# EAGLE schematic stm32-2inch40-usb-sd-proto (EAGLE 6.6.0)
+proto USB/SD 40 pin mesonine module. 2 inch beetween pinheads.

## Sheet 1 of 3
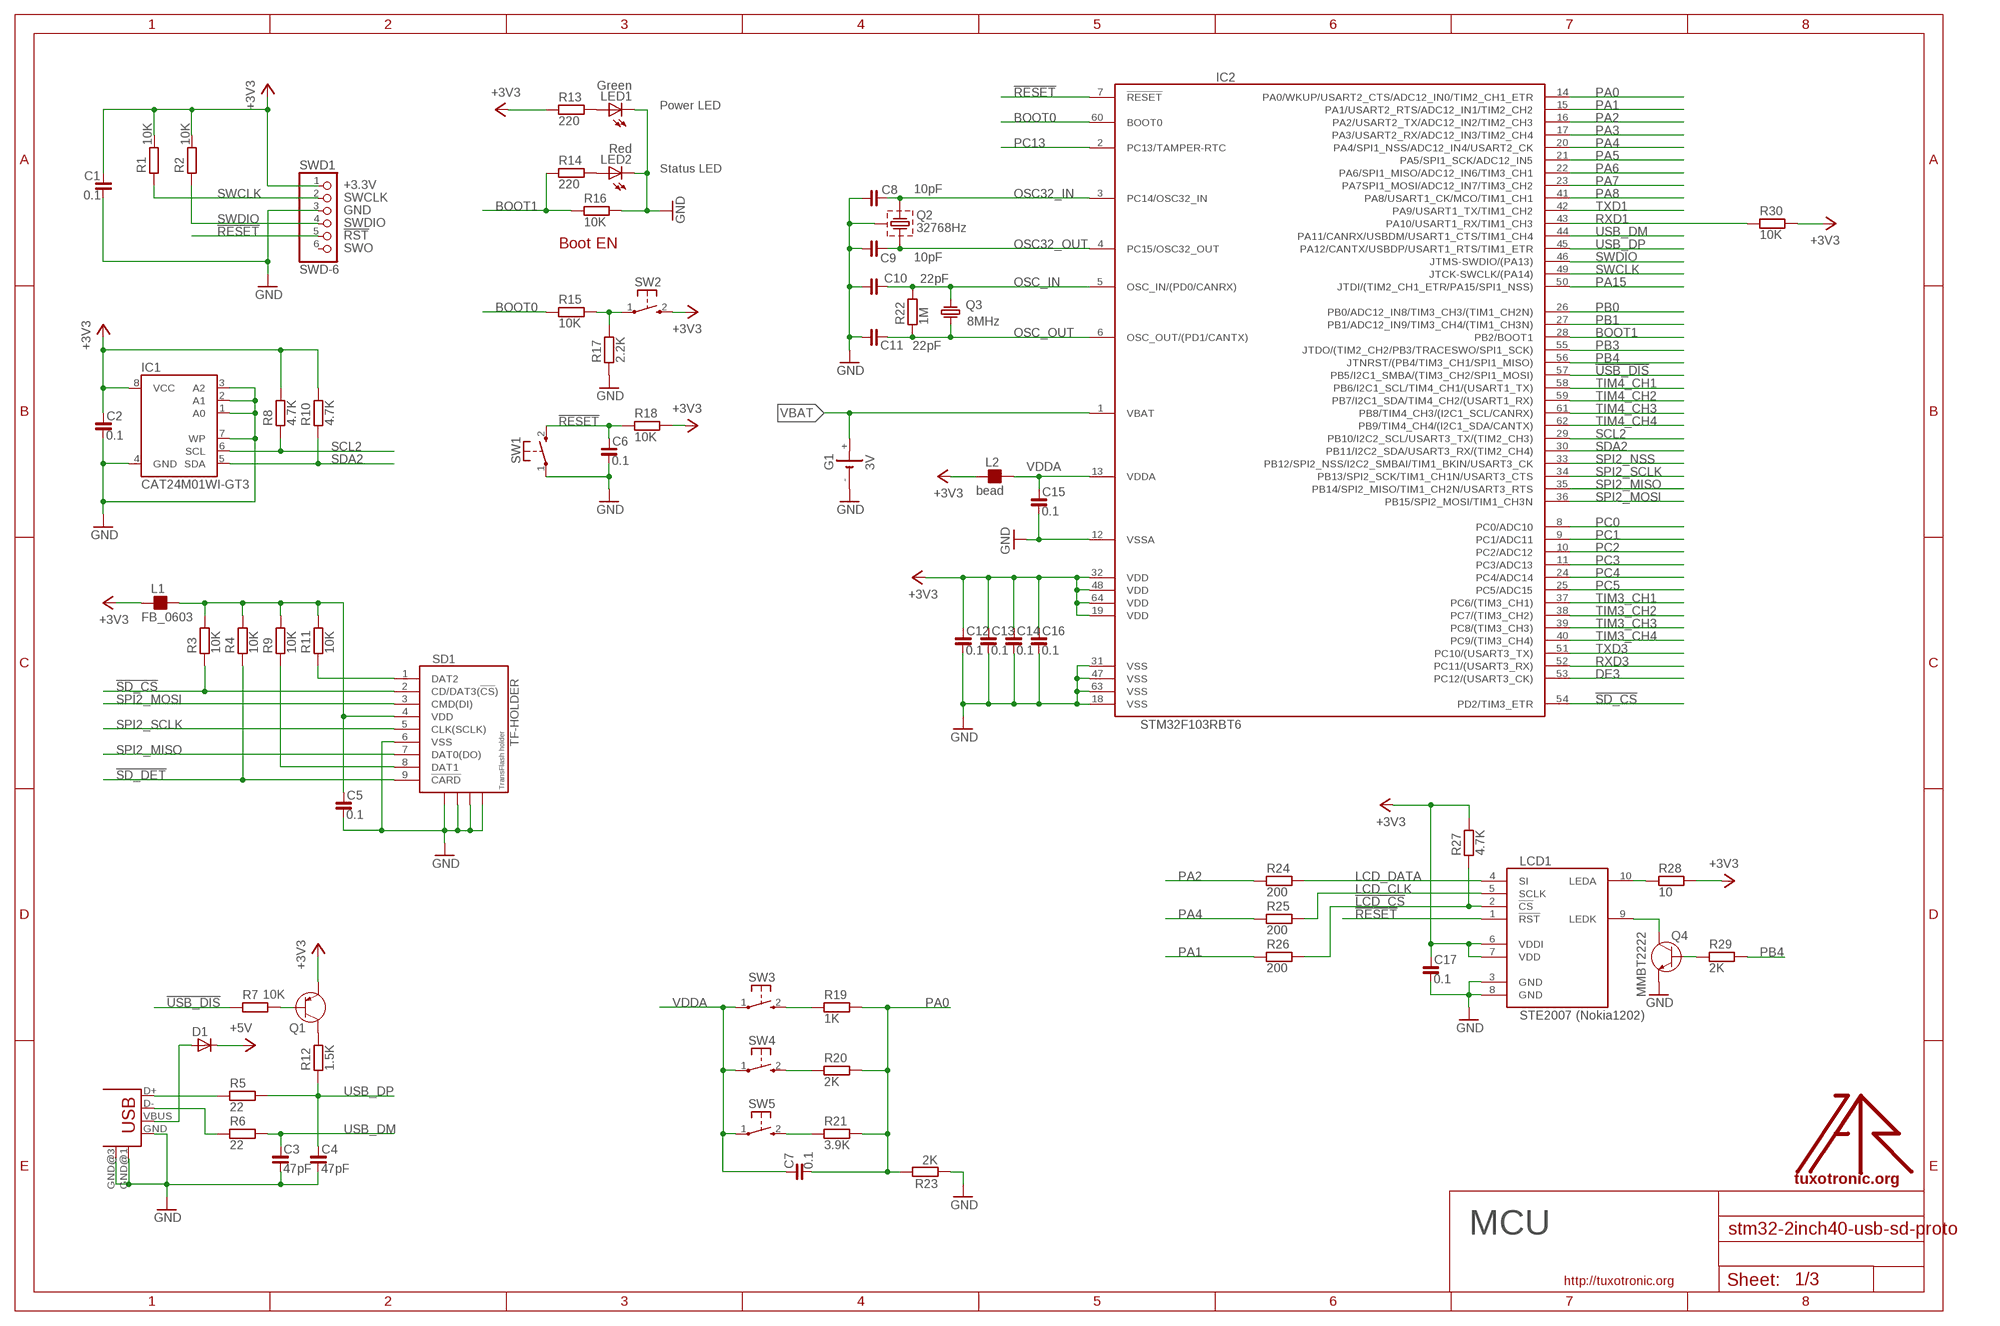
[diagram p0: schematic, sheet 1]

### Parts
C1  0.1  C_0603  [C0603]
C2  0.1  C_0603  [C0603]
C3  47pF  C_0603  [C0603]
C4  47pF  C_0603  [C0603]
C5  0.1  C_0603  [C0603]
C6  0.1  C_0603  [C0603]
C7  0.1  C_0603  [C0603]
C8  10pF  C_0603  [C0603]
C9  10pF  C_0603  [C0603]
C10  22pF  C_0603  [C0603]
C11  22pF  C_0603  [C0603]
C12  0.1  C_0603  [C0603]
C13  0.1  C_0603  [C0603]
C14  0.1  C_0603  [C0603]
C15  0.1  C_0603  [C0603]
C16  0.1  C_0603  [C0603]
C17  0.1  C_0603  [C0603]
D1  D-SOD-87  [SOD87]
G1  3V  1220SMT  [SMT1220]
IC1  CAT24M01WI-GT3  AT24C256S  [SO08]
IC2  STM32F103RBT6  STM32F103R  [TQFP64]
L1  FB_0603  [L0603]
L2  bead  FB_0603  [L0603]
LCD1  STE2007 (Nokia1202)  LCD1202-EXT  [NOKIA1202LCD-EXT]
LED1  Green  LEDCHIP-LED0805  [CHIP-LED0805]
LED2  Red  LEDCHIP-LED0805  [CHIP-LED0805]
LOGO1  LOGO  [TT_LOGO]
Q1  PNP-SOT23  [SOT23]
Q2  32768Hz  CRSTL3-  [TC38H-G]
Q3  8MHz  CRYSTAL-HC49S  [HC49/S]
Q4  MMBT2222  [SOT23]
R1  10K  R_0603  [R0603]
R2  10K  R_0603  [R0603]
R3  10K  R_0603  [R0603]
R4  10K  R_0603  [R0603]
R5  22  R_0603  [R0603]
R6  22  R_0603  [R0603]
R7  10K  R_0603  [R0603]
R8  4.7K  R_0603  [R0603]
R9  10K  R_0603  [R0603]
R10  4.7K  R_0603  [R0603]
R11  10K  R_0603  [R0603]
R12  1.5K  R_0603  [R0603]
R13  220  R_0603  [R0603]
R14  220  R_0603  [R0603]
R15  10K  R_0603  [R0603]
R16  10K  R_0603  [R0603]
R17  2.2K  R_0603  [R0603]
R18  10K  R_0603  [R0603]
R19  1K  R_0603  [R0603]
R20  2K  R_0603  [R0603]
R21  3.9K  R_0603  [R0603]
R22  1M  R_0603  [R0603]
R23  2K  R_0603  [R0603]
R24  200  R_0603  [R0603]
R25  200  R_0603  [R0603]
R26  200  R_0603  [R0603]
R27  4.7K  R_0603  [R0603]
R28  10  R_0603  [R0603]
R29  2K  R_0603  [R0603]
R30  10K  R_0603  [R0603]
SD1  TF-HOLDER  [TF-PULL]
SW1  KSS-2EG4430  [KSS-2EG4430]
SW2  KSS-2EG4430  [KSS-2EG4430]
SW3  KSS-2EG4430  [KSS-2EG4430]
SW4  KSS-2EG4430  [KSS-2EG4430]
SW5  KSS-2EG4430  [KSS-2EG4430]
SWD1  SWD-6  [JTAG6PIN]
USB1  USB-MB-S  [USB-MB-S]

### Nets
!LCD_CS: LCD1.2(!CS) R26.2 R27.1
!RESET: C6.1 IC2.7(!RESET) LCD1.1(!RST) R18.1 SW1.2(S) SWD1.5
!SD_CS: IC2.54(PD2/TIM3_ETR) R3.1 SD1.2(CD/DAT3(!CS!))
!SD_DET: R4.1 SD1.9(!CARD)
!USB_DIS: IC2.57(PB5/I2C1_SMBA/(TIM3_CH2/SPI1_MOSI)) R7.1
+3V3: C1.1 C2.1 C12.1 C13.1 C14.1 C16.1 C17.1 IC1.8(VCC) IC2.19(VDD) IC2.32(VDD) IC2.48(VDD) IC2.64(VDD) L1.1 L2.1 LCD1.6(VDDI) LCD1.7(VDD) Q1.2(E) R1.2 R2.2 R8.2 R10.2 R13.1 R18.2 R27.2 R28.2 R30.2 SW2.2(S) SWD1.1 ; also sheet 2
+5V: D1.1(C) ; also sheet 2
BOOT0: IC2.60(BOOT0) R15.1
BOOT1: IC2.28(PB2/BOOT1) R14.1 R16.1
DE3: IC2.53(PC12/(USART3_CK)) ; also sheet 2
GND: C1.2 C2.2 C3.2 C4.2 C5.2 C6.2 C8.2 C9.2 C10.2 C11.2 C12.2 C13.2 C14.2 C15.2 C16.2 C17.2 G1.- IC1.1(A0) IC1.2(A1) IC1.3(A2) IC1.4(GND) IC1.7(WP) IC2.12(VSSA) IC2.18(VSS) IC2.31(VSS) IC2.47(VSS) IC2.63(VSS) LCD1.3(GND) LCD1.8(GND) LED1.C LED2.C Q2.GND Q4.2(E) R16.2 R17.1 R23.1 SD1.6(VSS) SD1.S1 SD1.S2 SD1.S3 SD1.S4 SW1.1(P) SWD1.3 USB1.GND USB1.GND@1(GND) USB1.GND@3(GND) ; also sheet 2
LCD_CLK: LCD1.5(SCLK) R25.2
LCD_DATA: LCD1.4(SI) R24.2
N$1: Q1.3(C) R12.2
N$2: D1.2(A) USB1.VBUS
N$3: R15.2 R17.2 SW2.1(P)
N$7: C5.1 L1.2 R3.2 R4.2 R9.2 R11.2 SD1.4(VDD)
N$8: R11.1 SD1.1(DAT2)
N$9: R9.1 SD1.8(DAT1)
N$10: R5.1 USB1.D+
N$13: LED1.A R13.2
N$29: LCD1.9(LEDK) Q4.3(C)
N$30: LED2.A R14.2
N$31: LCD1.10(LEDA) R28.1
N$32: Q4.1(B) R29.1
N$33: R19.1 SW3.2(S)
N$34: R20.1 SW4.2(S)
N$35: R21.1 SW5.2(S)
N$36: R6.1 USB1.D-
N$38: Q1.1(B) R7.2
OSC32_IN: C8.1 IC2.3(PC14/OSC32_IN) Q2.2
OSC32_OUT: C9.1 IC2.4(PC15/OSC32_OUT) Q2.1
OSC_IN: C10.1 IC2.5(OSC_IN/(PD0/CANRX)) Q3.1 R22.2
OSC_OUT: C11.1 IC2.6(OSC_OUT/(PD1/CANTX)) Q3.2 R22.1
PA0: C7.2 IC2.14(PA0/WKUP/USART2_CTS/ADC12_IN0/TIM2_CH1_ETR) R19.2 R20.2 R21.2 R23.2 ; also sheet 2
PA1: IC2.15(PA1/USART2_RTS/ADC12_IN1/TIM2_CH2) R26.1 ; also sheet 2
PA2: IC2.16(PA2/USART2_TX/ADC12_IN2/TIM2_CH3) R24.1 ; also sheet 2
PA3: IC2.17(PA3/USART2_RX/ADC12_IN3/TIM2_CH4) ; also sheet 2
PA4: IC2.20(PA4/SPI1_NSS/ADC12_IN4/USART2_CK) R25.1 ; also sheet 2
PA5: IC2.21(PA5/SPI1_SCK/ADC12_IN5) ; also sheet 2
PA6: IC2.22(PA6/SPI1_MISO/ADC12_IN6/TIM3_CH1) ; also sheet 2
PA7: IC2.23(PA7SPI1_MOSI/ADC12_IN7/TIM3_CH2) ; also sheet 2
PA8: IC2.41(PA8/USART1_CK/MCO/TIM1_CH1) ; also sheet 2
PA15: IC2.50(JTDI/(TIM2_CH1_ETR/PA15/SPI1_NSS)) ; also sheet 2
PB0: IC2.26(PB0/ADC12_IN8/TIM3_CH3/(TIM1_CH2N)) ; also sheet 2
PB1: IC2.27(PB1/ADC12_IN9/TIM3_CH4/(TIM1_CH3N)) ; also sheet 2
PB3: IC2.55(JTDO/(TIM2_CH2/PB3/TRACESWO/SPI1_SCK)) ; also sheet 2
PB4: IC2.56(JTNRST/(PB4/TIM3_CH1/SPI1_MISO)) R29.2
PC0: IC2.8(PC0/ADC10) ; also sheet 2
PC1: IC2.9(PC1/ADC11) ; also sheet 2
PC2: IC2.10(PC2/ADC12) ; also sheet 2
PC3: IC2.11(PC3/ADC13) ; also sheet 2
PC4: IC2.24(PC4/ADC14) ; also sheet 2
PC5: IC2.25(PC5/ADC15) ; also sheet 2
PC13: IC2.2(PC13/TAMPER-RTC) ; also sheet 2
RXD1: IC2.43(PA10/USART1_RX/TIM1_CH3) R30.1 ; also sheet 2
RXD3: IC2.52(PC11/(USART3_RX)) ; also sheet 2
SCL2: IC1.6(SCL) IC2.29(PB10/I2C2_SCL/USART3_TX/(TIM2_CH3)) R8.1 ; also sheet 2
SDA2: IC1.5(SDA) IC2.30(PB11/I2C2_SDA/USART3_RX/(TIM2_CH4)) R10.1 ; also sheet 2
SPI2_MISO: IC2.35(PB14/SPI2_MISO/TIM1_CH2N/USART3_RTS) SD1.7(DAT0(DO)) ; also sheet 2
SPI2_MOSI: IC2.36(PB15/SPI2_MOSI/TIM1_CH3N) SD1.3(CMD(DI)) ; also sheet 2
SPI2_NSS: IC2.33(PB12/SPI2_NSS/I2C2_SMBAI/TIM1_BKIN/USART3_CK) ; also sheet 2
SPI2_SCLK: IC2.34(PB13/SPI2_SCK/TIM1_CH1N/USART3_CTS) SD1.5(CLK(SCLK)) ; also sheet 2
SWCLK: IC2.49(JTCK-SWCLK/(PA14)) R1.1 SWD1.2
SWDIO: IC2.46(JTMS-SWDIO/(PA13)) R2.1 SWD1.4
TIM3_CH1: IC2.37(PC6/(TIM3_CH1)) ; also sheet 2
TIM3_CH2: IC2.38(PC7/(TIM3_CH2)) ; also sheet 2
TIM3_CH3: IC2.39(PC8/(TIM3_CH3)) ; also sheet 2
TIM3_CH4: IC2.40(PC9/(TIM3_CH4)) ; also sheet 2
TIM4_CH1: IC2.58(PB6/I2C1_SCL/TIM4_CH1/(USART1_TX)) ; also sheet 2
TIM4_CH2: IC2.59(PB7/I2C1_SDA/TIM4_CH2/(USART1_RX)) ; also sheet 2
TIM4_CH3: IC2.61(PB8/TIM4_CH3/(I2C1_SCL/CANRX)) ; also sheet 2
TIM4_CH4: IC2.62(PB9/TIM4_CH4/(I2C1_SDA/CANTX)) ; also sheet 2
TXD1: IC2.42(PA9/USART1_TX/TIM1_CH2) ; also sheet 2
TXD3: IC2.51(PC10/(USART3_TX)) ; also sheet 2
USB_DM: C3.1 IC2.44(PA11/CANRX/USBDM/USART1_CTS/TIM1_CH4) R6.2
USB_DP: C4.1 IC2.45(PA12/CANTX/USBDP/USART1_RTS/TIM1_ETR) R5.2 R12.1
VBAT: G1.+ IC2.1(VBAT)
VDDA: C7.1 C15.1 IC2.13(VDDA) L2.2 SW3.1(P) SW4.1(P) SW5.1(P)
Unconnected: SWD1.6

### Notes on the sheet
- Power LED
- Status LED
- Boot EN
- MCU

## Sheet 2 of 3
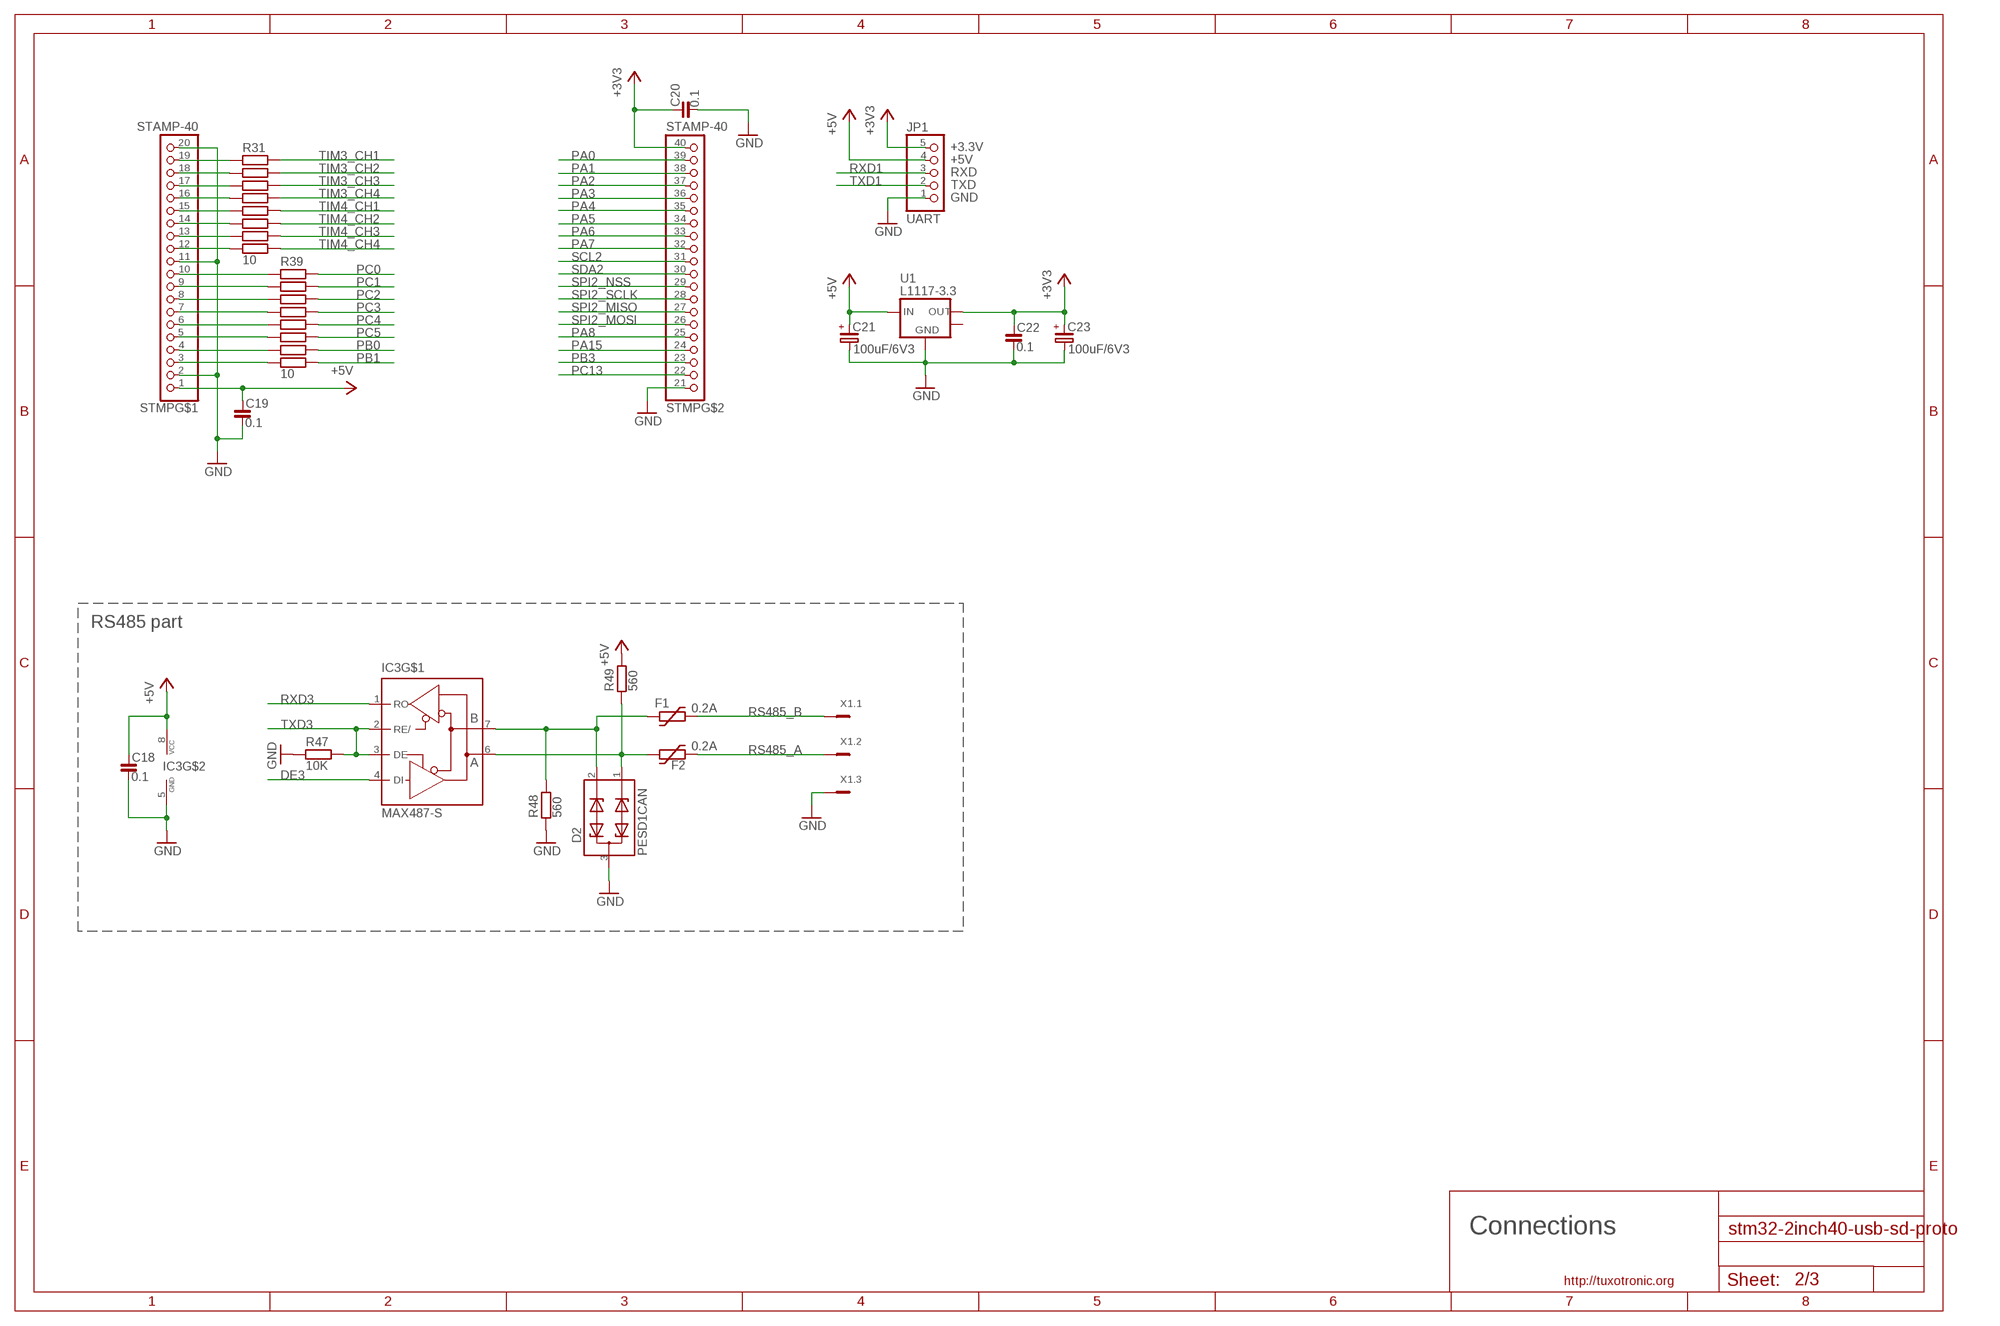
[diagram p1: schematic, sheet 2]

### Parts
C18  0.1  C_0603  [C0603]
C19  0.1  C_0805  [C0805]
C20  0.1  C_0805  [C0805]
C21  100uF/6V3  CP_SMCD  [SMC_D]
C22  0.1  C_0805  [C0805]
C23  100uF/6V3  CP_SMCD  [SMC_D]
D2  PESD1CAN  [SOT23]
F1  0.2A  1206L  [1206L]
F2  0.2A  1206L  [1206L]
IC3  MAX487-S  [SO08]
JP1  UART  UART-5_2.54  [UART_1X05]
R31  10  R_0603  [R0603]
R32  10  R_0603  [R0603]
R33  10  R_0603  [R0603]
R34  10  R_0603  [R0603]
R35  10  R_0603  [R0603]
R36  10  R_0603  [R0603]
R37  10  R_0603  [R0603]
R38  10  R_0603  [R0603]
R39  10  R_0603  [R0603]
R40  10  R_0603  [R0603]
R41  10  R_0603  [R0603]
R42  10  R_0603  [R0603]
R43  10  R_0603  [R0603]
R44  10  R_0603  [R0603]
R45  10  R_0603  [R0603]
R46  10  R_0603  [R0603]
R47  10K  R_0603  [R0603]
R48  560  R_0603  [R0603]
R49  560  R_0603  [R0603]
STMP  STAMP-40  [STAMP-40]
U1  L1117-3.3  LM1117-3.3  [SOT223]
X1  MCV3  [MCV3]

### Nets
+3V3: C20.1 C22.1 C23.+ JP1.5 STMP.40 U1.2(OUT) ; also sheet 1
+5V: C18.1 C19.1 C21.+ IC3.8(VCC) JP1.4 R49.2 STMP.1 U1.3(IN) ; also sheet 1
DE3: IC3.4(DI) ; also sheet 1
GND: C18.2 C19.2 C20.2 C21.- C22.2 C23.- D2.3 IC3.5(GND) JP1.1 R47.1 R48.1 STMP.2 STMP.11 STMP.20 STMP.21 U1.1(GND) X1.3 ; also sheet 1
N$6: D2.2 F1.P$1 IC3.7(B) R48.2
N$11: R39.1 STMP.10
N$14: R40.1 STMP.9
N$15: R31.1 STMP.19
N$16: R32.1 STMP.18
N$17: R33.1 STMP.17
N$18: R34.1 STMP.16
N$19: R35.1 STMP.15
N$20: R36.1 STMP.14
N$21: R37.1 STMP.13
N$22: R38.1 STMP.12
N$23: R41.1 STMP.8
N$24: R42.1 STMP.7
N$25: R43.1 STMP.6
N$26: R44.1 STMP.5
N$27: R45.1 STMP.4
N$28: R46.1 STMP.3
N$44: D2.1 F2.P$1 IC3.6(A) R49.1
PA0: STMP.39 ; also sheet 1
PA1: STMP.38 ; also sheet 1
PA2: STMP.37 ; also sheet 1
PA3: STMP.36 ; also sheet 1
PA4: STMP.35 ; also sheet 1
PA5: STMP.34 ; also sheet 1
PA6: STMP.33 ; also sheet 1
PA7: STMP.32 ; also sheet 1
PA8: STMP.25 ; also sheet 1
PA15: STMP.24 ; also sheet 1
PB0: R45.2 ; also sheet 1
PB1: R46.2 ; also sheet 1
PB3: STMP.23 ; also sheet 1
PC0: R39.2 ; also sheet 1
PC1: R40.2 ; also sheet 1
PC2: R41.2 ; also sheet 1
PC3: R42.2 ; also sheet 1
PC4: R43.2 ; also sheet 1
PC5: R44.2 ; also sheet 1
PC13: STMP.22 ; also sheet 1
RS485_A: F2.P$2 X1.2
RS485_B: F1.P$2 X1.1
RXD1: JP1.3 ; also sheet 1
RXD3: IC3.1(RO) ; also sheet 1
SCL2: STMP.31 ; also sheet 1
SDA2: STMP.30 ; also sheet 1
SPI2_MISO: STMP.27 ; also sheet 1
SPI2_MOSI: STMP.26 ; also sheet 1
SPI2_NSS: STMP.29 ; also sheet 1
SPI2_SCLK: STMP.28 ; also sheet 1
TIM3_CH1: R31.2 ; also sheet 1
TIM3_CH2: R32.2 ; also sheet 1
TIM3_CH3: R33.2 ; also sheet 1
TIM3_CH4: R34.2 ; also sheet 1
TIM4_CH1: R35.2 ; also sheet 1
TIM4_CH2: R36.2 ; also sheet 1
TIM4_CH3: R37.2 ; also sheet 1
TIM4_CH4: R38.2 ; also sheet 1
TXD1: JP1.2 ; also sheet 1
TXD3: IC3.2(RE/) IC3.3(DE) R47.2 ; also sheet 1
Unconnected: U1.4(MASS)

### Notes on the sheet
- RS485 part
- Connections

## Sheet 3 of 3
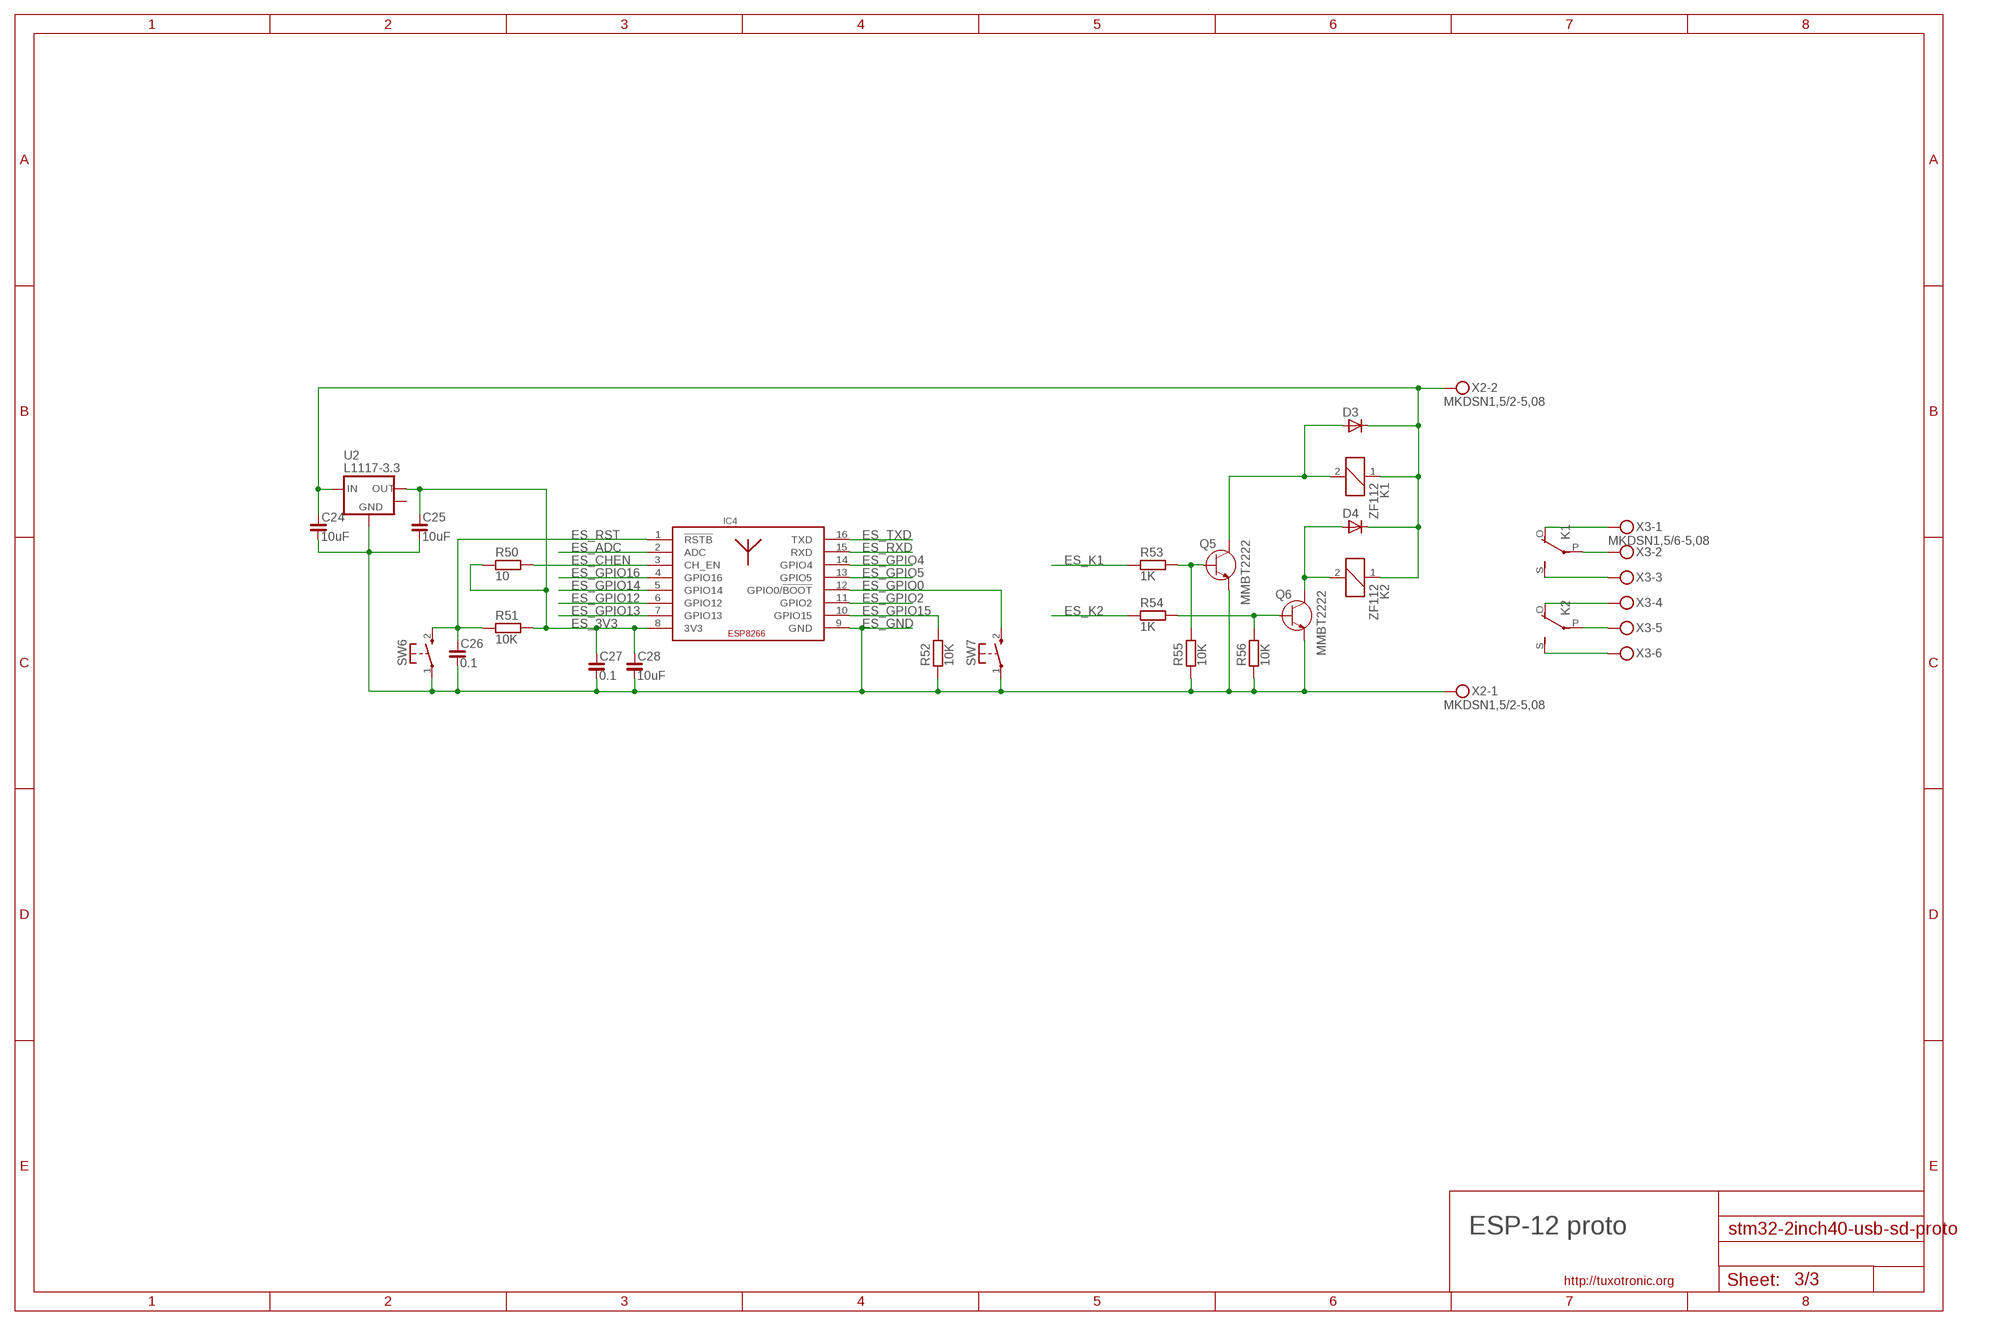
[diagram p2: schematic, sheet 3]

### Parts
C24  10uF  C_0805  [C0805]
C25  10uF  C_0805  [C0805]
C26  0.1  C_0805  [C0805]
C27  0.1  C_0805  [C0805]
C28  10uF  C_0805  [C0805]
D3  D-SOD-80  [SOD80]
D4  D-SOD-80  [SOD80]
IC4  ESP-12  [ESP12]
K1  ZF112  [ZF112]
K2  ZF112  [ZF112]
Q5  MMBT2222  [SOT23]
Q6  MMBT2222  [SOT23]
R50  10  R_0805  [R0805]
R51  10K  R_0805  [R0805]
R52  10K  R_0805  [R0805]
R53  1K  R_0805  [R0805]
R54  1K  R_0805  [R0805]
R55  10K  R_0805  [R0805]
R56  10K  R_0805  [R0805]
SW6  KSS-2EG4430  [KSS-2EG4430]
SW7  KSS-2EG4430  [KSS-2EG4430]
U2  L1117-3.3  LM1117-3.3  [SOT223]
X2  MKDSN1,5/2-5,08  [MKDSN1,5/2-5,08]
X3  MKDSN1,5/6-5,08  [MKDSN1,5/6-5,08]

### Nets
+5V1: C24.1 D3.1(C) D4.1(C) K1.1 K2.1 U2.3(IN) X2.2
ES_3V3: C25.1 C27.1 C28.1 IC4.8(3V3) R50.1 R51.2 U2.2(OUT)
ES_ADC: IC4.2(ADC)
ES_CHEN: IC4.3(CH_EN) R50.2
ES_GND: C24.2 C25.2 C26.2 C27.2 C28.2 IC4.9(GND) Q5.2(E) Q6.2(E) R52.1 R55.1 R56.1 SW6.1(P) SW7.1(P) U2.1(GND) X2.1
ES_GPIO0: IC4.12(GPIO0/!BOOT) SW7.2(S)
ES_GPIO2: IC4.11(GPIO2)
ES_GPIO4: IC4.14(GPIO4)
ES_GPIO5: IC4.13(GPIO5)
ES_GPIO12: IC4.6(GPIO12)
ES_GPIO13: IC4.7(GPIO13)
ES_GPIO14: IC4.5(GPIO14)
ES_GPIO15: IC4.10(GPIO15) R52.2
ES_GPIO16: IC4.4(GPIO16)
ES_K1: R53.1
ES_K2: R54.1
ES_RST: C26.1 IC4.1(!RSTB) R51.1 SW6.2(S)
ES_RXD: IC4.15(RXD)
ES_TXD: IC4.16(TXD)
N$37: Q6.1(B) R54.2 R56.2
N$41: D4.2(A) K2.2 Q6.3(C)
N$42: D3.2(A) K1.2 Q5.3(C)
N$46: Q5.1(B) R53.2 R55.2
N$47: K1.O(2:O) X3.1
N$50: K1.P(2:P) X3.2
N$51: K1.S(2:S) X3.3
N$52: K2.O(2:O) X3.4
N$53: K2.P(2:P) X3.5
N$55: K2.S(2:S) X3.6
Unconnected: U2.4(MASS)

### Notes on the sheet
- ESP-12 proto

## Library data of the parts
C1-C20 C22 C24-C28 = rc-master-smd:C_: NON-POLARIZED CAP
C21 C23 = rc-master-smd:CP_: POLARIZED CAP
D1 D3 D4 = semicon-smd-ipc:D-: DIODE unfilled
D2 = protect:PESD1CAN: Features Due to the integrated diode structure only one small SOT23 package is needed to protect two CAN bus lines Max. peak pulse power: PPP = 200 W at tp = 8/20 ?s Low clamping voltage: VCL = 40 V at IPP = 1 A Ultra low leakage current: IRM < 1 nA ESD protection up to 23 kV IEC 61000-4-2, level 4 (ESD) IEC 61000-4-5 (surge); IPP = 3 A at tp = 8/20 ?s Small SMD plastic package Applications CAN bus protection Automotive applications
F1 F2 = ptc-littlefuse:1206L
G1 = battery:1220SMT
IC1 = stm32-by-pb:AT24C*: 2-wire serial EEPROM
IC2 = stm32:STM32F103R: Medium-density performance line ARM-based 32-bit MCU with 64 or 128 KB Flash, USB, CAN, 7 timers, 2 ADCs, 9 communication interfaces
IC3 = rs232-rs485:MAX487: RS485 TRANSEIVER
IC4 = esp-modules:ESP-12
JP1 = stamp:UART-5: PIN HEADER
K1 K2 = myrelays:ZF112: RELAY 1 x switch
L1 L2 = rc-master-smd:FB_: FERRITE BEAD
LCD1 = lcd1202:LCD1202: 1.3" b/w graphics display 96x68 pixel. From Nokia 1202 cell phone
LED1 LED2 = led:LED: LED OSRAM: - CHIPLED LG R971, LG N971, LY N971, LG Q971, LY Q971, LO R971, LY R971 LH N974, LH R974 LS Q976, LO Q976, LY Q976 LO Q996 - Hyper CHIPLED LW Q18S LB Q993, LB Q99A, LB R99A - SideLED LS A670, LO A670, LY A670, LG A670, LP A670 LB A673, LV A673, LT A673, LW A673 LH A674 LY A675 LS A676, LA A676, LO A676, LY A676, LW A676 LS A679, LY A679, LG A679 - Hyper Micro SIDELED® LS Y876, LA Y876, LO Y876, LY Y876 LT Y87S - SmartLED LW L88C, LW L88S LB L89C, LB L89S, LG L890 LS L89K, LO L89K, LY L89K LS L896, LA L896, LO L896, LY L896 - TOPLED LS T670, LO T670, LY T670, LG T670, LP T670 LSG T670, LSP T670, LSY T670, LOP T670, LYG T670 LG T671, LOG T671, LSG T671 LB T673, LV T673, LT T673, LW T673 LH T674 LS T676, LA T676, LO T676, LY T676, LB T676, LH T676, LSB T676, LW T676 LB T67C, LV T67C, LT T67C, LS T67K, LO T67K, LY T67K, LW E67C LS E67B, LA E67B, LO E67B, LY E67B, LB E67C, LV E67C, LT E67C LW T67C LS T679, LY T679, LG T679 LS T770, LO T770, LY T770, LG T770, LP T770 LB T773, LV T773, LT T773, LW T773 LH T774 LS E675, LA E675, LY E675, LS T675 LS T776, LA T776, LO T776, LY T776, LB T776 LHGB T686 LT T68C, LB T68C - Hyper Mini TOPLED® LB M676 - Mini TOPLED Santana® LG M470 LS M47K, LO M47K, LY M47K Source: http://www.osram.convergy.de LUXEON: - LUMILED® LXK2-PW12-R00, LXK2-PW12-S00, LXK2-PW14-U00, LXK2-PW14-V00 LXK2-PM12-R00, LXK2-PM12-S00, LXK2-PM14-U00 LXK2-PE12-Q00, LXK2-PE12-R00, LXK2-PE12-S00, LXK2-PE14-T00, LXK2-PE14-U00 LXK2-PB12-K00, LXK2-PB12-L00, LXK2-PB12-M00, LXK2-PB14-N00, LXK2-PB14-P00, LXK2-PB14-Q00 LXK2-PR12-L00, LXK2-PR12-M00, LXK2-PR14-Q00, LXK2-PR14-R00 LXK2-PD12-Q00, LXK2-PD12-R00, LXK2-PD12-S00 LXK2-PH12-R00, LXK2-PH12-S00 LXK2-PL12-P00, LXK2-PL12-Q00, LXK2-PL12-R00 Source: www.luxeon.com KINGBRIGHT: KA-3528ASYC Source: www.kingbright.com
LOGO1 = logo:LOGO
Q1 = semiconductor:PNP-
Q2 = crystal:CRSTL3-
Q3 = discrete:CRYSTAL-: CRYSTAL
Q4-Q6 = semiconductor:MMBT2222: General Purpose Transistors NPN Silicon Rating MMBT2222LT1G MMBT2222ALT1G Collector-Emitter Voltage (VCEO) 30 Vdc 40 Vdc Collector-Base Voltage (VCBO) 60 Vdc 75 Vdc Emitter-Base Voltage (VEBO) 5.0 Vdc 6.0 Vdc Collector Current Continuous (IC) 600 mAdc 1100 mAdc Collector Current Peak (ICM) 600 mAdc 1100 mAdc
R1-R56 = rc-master-smd:R_: RESISTOR
SD1 = sd-mmc:TF-HOLDER: TF / Micro SD socket is PUSH-PUSH type, the card can be pushed into and auto locked and pushed out by simply press the card. Surface Mounting type.
STMP = stamp:STAMP-40
SW1-SW7 = buttons:KSS-2EG4430: Size: 3x6mm Height: 5mm from PCB Rating: DC12v 50mA Travel: 0.25±0.10mm Operating Force: 180±50gf Return Force: 60gf min Contact resistance: 100m? max Insulation resistance: 100M? min Operating life?50,000 cycles
SWD1 = jtag:SWD-6: STM32Fx Discovery
U1 U2 = vreg-linear:LM1117: Linear regulators
USB1 = usb:USB: USB Connectors
X1 = con-phoenix-381_l:MCV3: Mini-Combicon 3.81mm vertikal 3polig (ohne Gegenstecker)
X2 = con-phoenix-508:MKDSN1,5/2-5,08: MKDSN 1,5/ 2-5,08 Printklemme Nennstrom: 13,5 A Nennspannung: 250 V Rastermaß: 5,08 mm Polzahl: 2 Anschlussart: Schraubanschluss Montage: Löten Anschlussrichtung Leiter/Platine: 0 ° Artikelnummer: 1729128 Source: http://eshop.phoenixcontact.com .. 1729128.pdf
X3 = con-phoenix-508:MKDSN1,5/6-5,08: MKDSN 1,5/ 6-5,08 Printklemme Nennstrom: 13,5 A Nennspannung: 250 V Rastermaß: 5,08 mm Polzahl: 6 Anschlussart: Schraubanschluss Montage: Löten Anschlussrichtung Leiter/Platine: 0 ° Artikelnummer: 1729160 Source: http://eshop.phoenixcontact.com .. 1729160.pdf